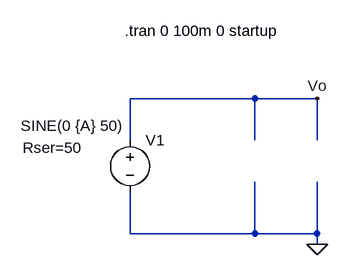
[diagram p0: schematic clipper1.asc]
clipper1.asc, the LTspice schematic file:
Version 4
SHEET 1 880 680
WIRE -304 -16 -496 -16
WIRE -208 -16 -304 -16
WIRE -496 48 -496 -16
WIRE -304 48 -304 -16
WIRE -208 48 -208 -16
WIRE -496 192 -496 128
WIRE -304 192 -304 112
WIRE -304 192 -496 192
WIRE -208 192 -208 112
WIRE -208 192 -304 192
WIRE -208 208 -208 192
FLAG -208 208 0
FLAG -208 -16 Vo
SYMBOL voltage -496 32 R0
WINDOW 3 -168 -6 Left 2
WINDOW 123 0 0 Left 2
WINDOW 39 -165 28 Left 2
SYMATTR Value SINE(0 {A} 50)
SYMATTR SpiceLine Rser=50
SYMATTR InstName V1
TEXT -504 -120 Left 2 !.tran 0 100m 0 startup

The netlist it stands for:
* clipper1.asc
V1 Vo 0 SINE(0 {A} 50) Rser=50
.tran 0 100m 0 startup
.backanno
.end